# EAGLE board S7G7_footprint_simplified_w_ethernet_v1p17 (EAGLE 9.5.2)
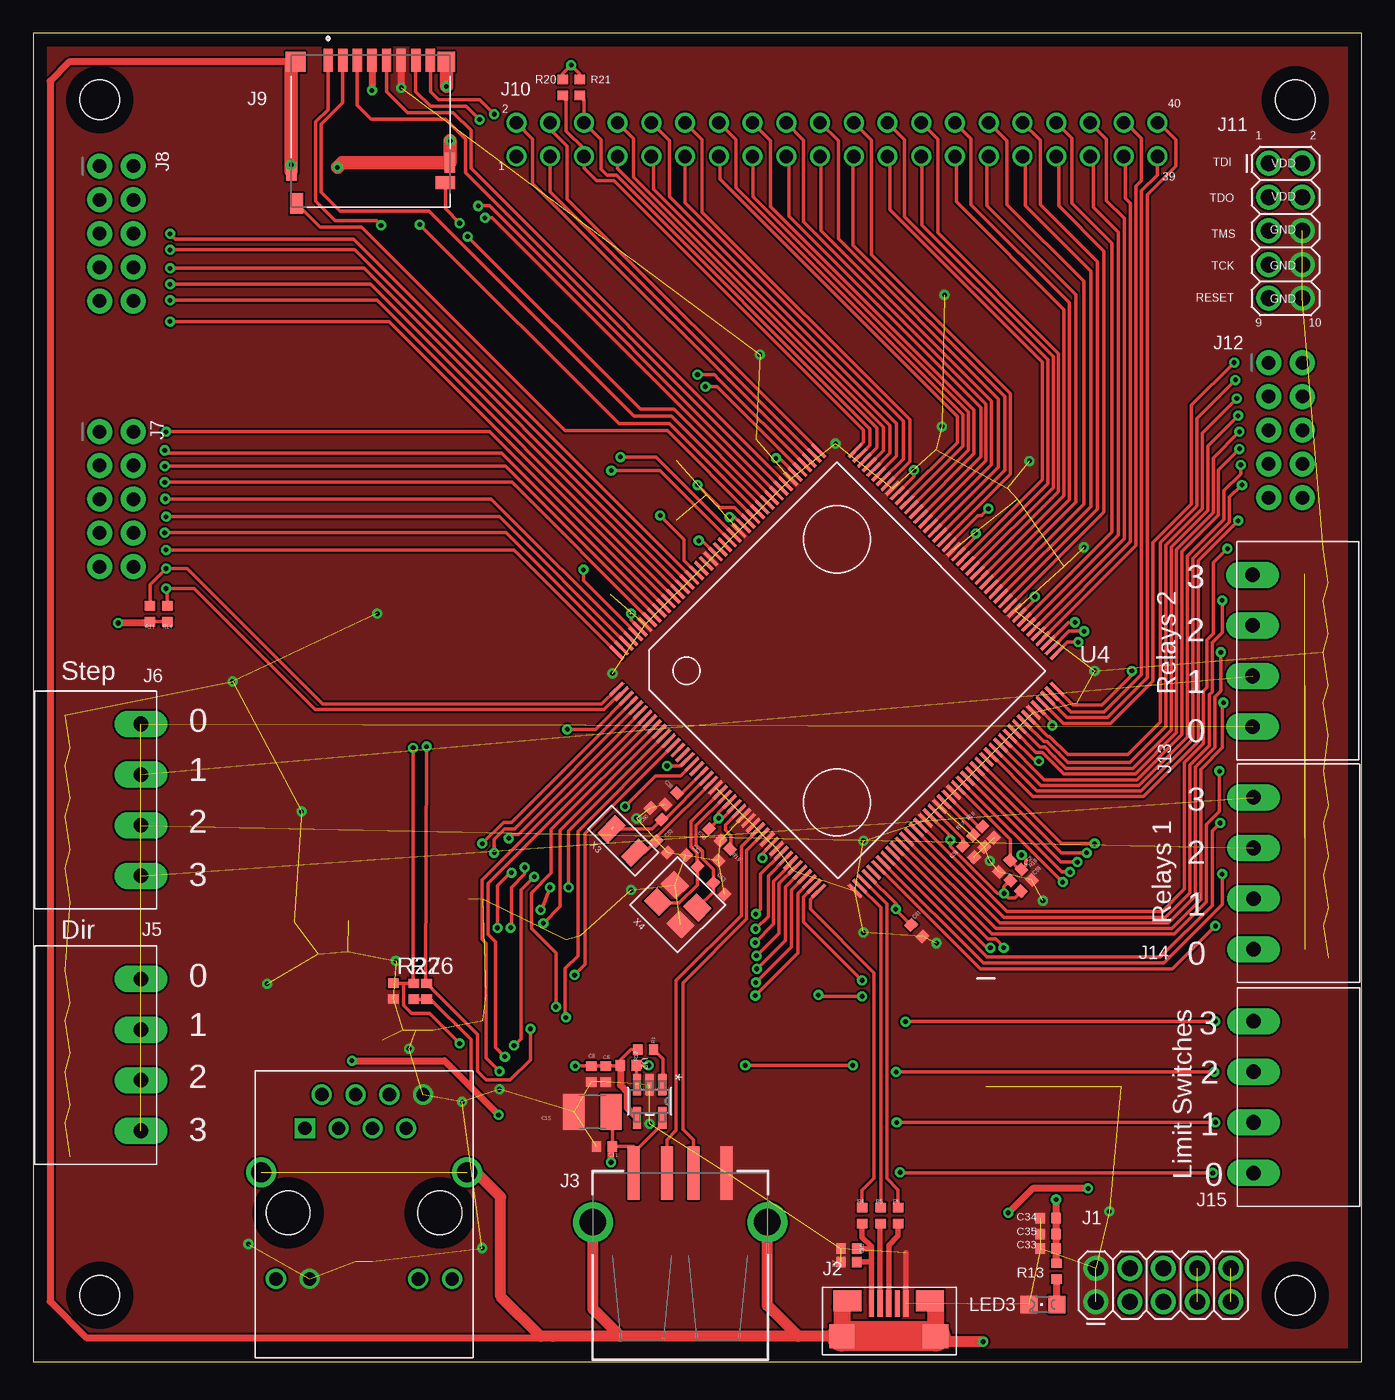
[diagram p5: board, top side]
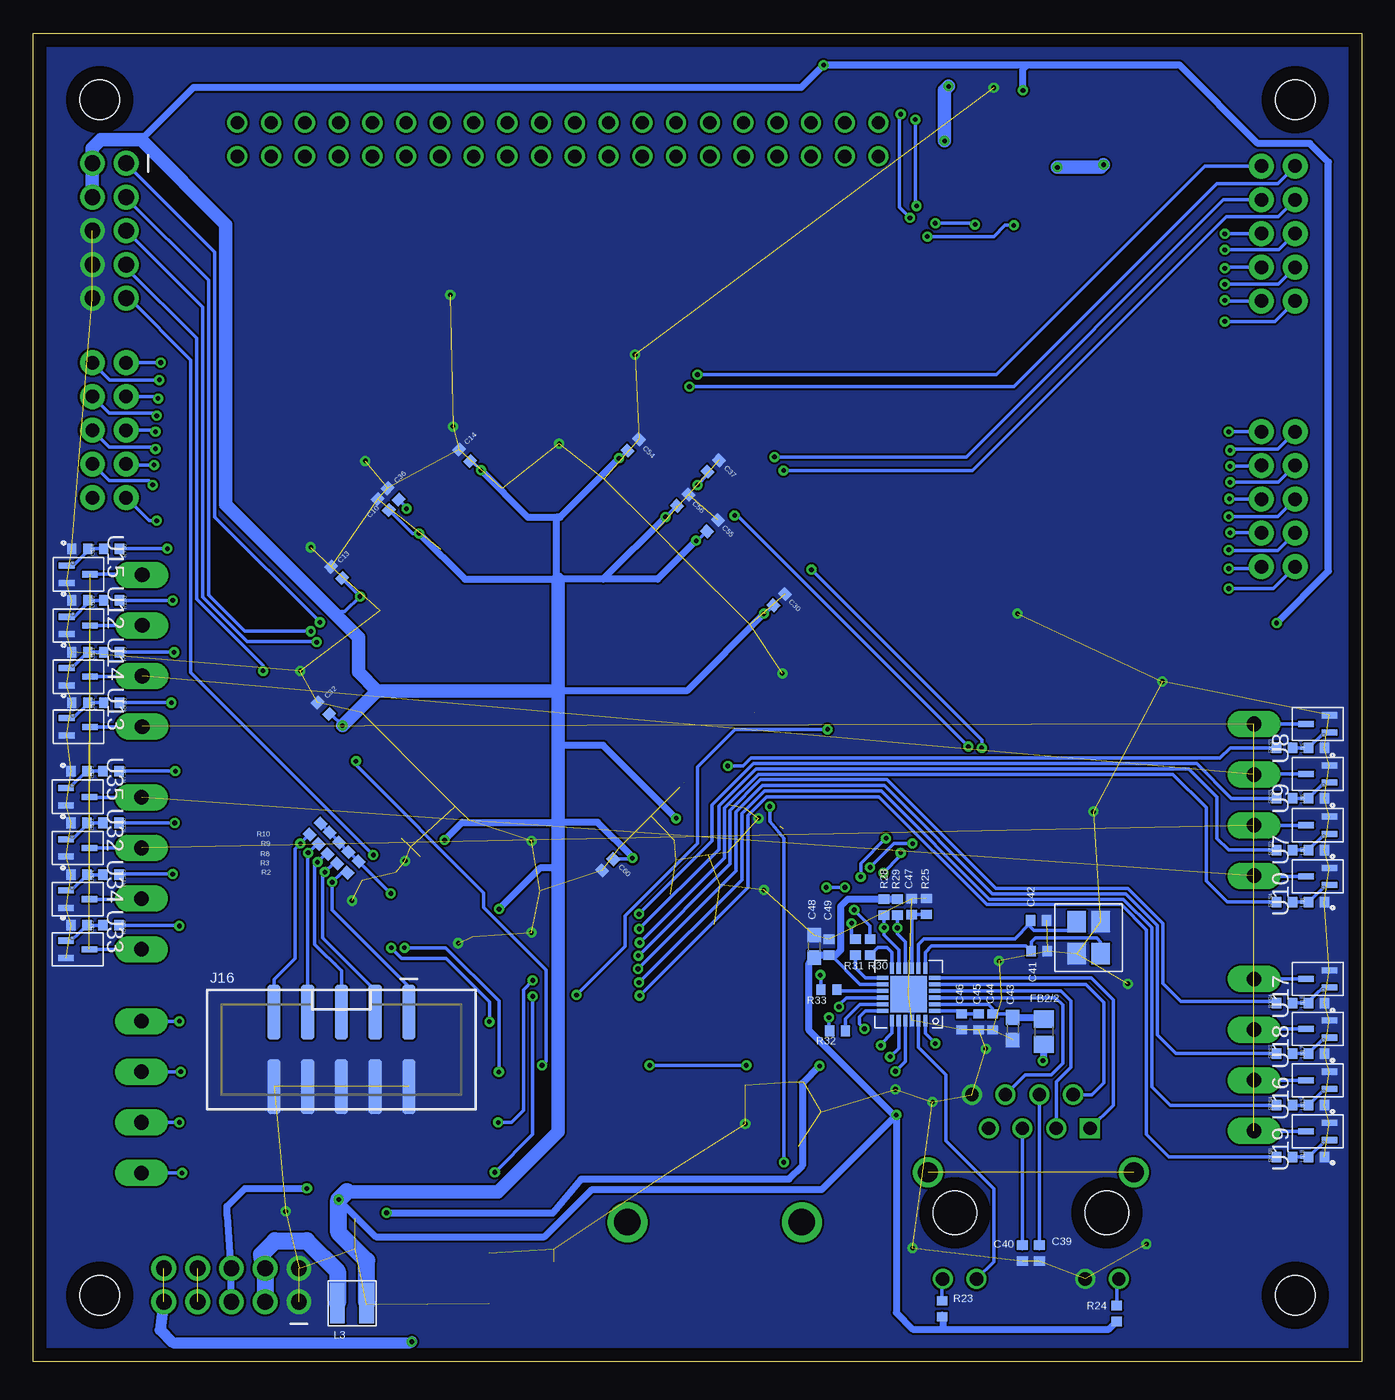
[diagram p6: board, bottom side, seen from below]

Size 100 x 100 mm. Coordinates in mm from the lower left corner, seen from the top.
Outline: 0,0 100,0 100,100 0,100 0,0
Copper layers (1*16): Top 0.035mm / dielectric 1.5mm / Bottom 0.035mm
Design rules "default": minimum track width 6mil, minimum drill 0.35mm, track to track 6mil, track to pad 6mil, pad to pad 6mil, via to via 6mil, smd to smd 6mil, copper to edge 40mil, drill to drill 6mil, minimum pad ring 10mil, minimum via ring 8mil, stop-mask expansion 4mil, vias tented up to drill 0mil, thermal gap 10mil
Holes 3 mm at 5,95 95,95 95,5 5,5

## Footprints (pad centres in the part's own frame; a part is rotated, then mirrored left to right if it is on the bottom)
0402 = smd 0.8 x 0.7: P$1 0,0.6; P$2 0,-0.6
C1210 = smd 1.6 x 2.7: 1 -1.4,0; 2 1.4,0
0603 = smd 1.1 x 1: 1 -0.85,0; 2 0.85,0
0805 = smd 1.3 x 1.5: 1 -0.95,0; 2 0.95,0
2X5 = drill 1.2 pad 1.88: 1 0,0; 2 0,2.54; 3 2.54,0; 4 2.54,2.54; 5 5.08,0; 6 5.08,2.54; 7 7.62,0; 8 7.62,2.54; 9 10.16,0; 10 10.16,2.54
USB_MICRO-B = smd 0.4 x 2: P$1 -1.3,2.475; P$2 -0.65,2.475; P$3 0,2.475; P$4 0.65,2.475; P$5 1.3,2.475 | smd 2.1 x 1.6: P$6 -3.1,2.675; P$7 3.1,2.675 | smd 1.9 x 1.8: P$8 -3.525,0; P$9 3.525,0
USB_A_SMT = smd 4 x 0.9: D+ 6.7,-1; D- 6.7,1; GND 6.7,-3.5; VBUS 6.7,3.5 | drill 2: SHLD1 3,-6.566; SHLD2 3,6.566
RJ45_TH_ELEC = drill 1 square: 1 -4.45,-2.54 | drill 1: 2 -3.18,0; 3 -1.91,-2.54; 4 -0.635,0; 5 0.635,-2.54; 6 1.91,0; 7 3.17,-2.54; 8 4.445,0; 9 -6.63,-13.88; 10 -4.09,-13.88; 11 4.09,-13.88; 12 6.63,-13.88 | drill 1.5: 13 -7.75,-5.84; 14 7.75,-5.84 | hole 3.299: 5.715,-8.89; -5.715,-8.89
1X4_3.81MM_PITCH = drill 1.1 pad 2 long: P$1 0,0; P$2 3.81,0; P$3 7.62,0; P$4 11.43,0
2X5_NOSILK = drill 1.016 pad 1.88: 1 0,0; 2 0,2.54; 3 2.54,0; 4 2.54,2.54; 5 5.08,0; 6 5.08,2.54; 7 7.62,0; 8 7.62,2.54; 9 10.16,0; 10 10.16,2.54
AMPHENOL_1140084168 = smd 0.7 x 1.75: 1 3.2,-0.875; 2 2.1,-0.875; 3 1,-0.875; 4 -0.1,-0.875; 5 -1.2,-0.875; 6 -2.3,-0.875; 7 -3.4,-0.875; 8 -4.5,-0.875 | smd 1 x 1.55: 9 5.575,9.925 | smd 1.45 x 1: 10 -5.625,8.35 | smd 1.5 x 1.5: S1 5.65,-0.75 | smd 1.3 x 1.5: S2 -5.7,-0.75 | smd 0.8 x 1.4: S3 5.975,7.5 | smd 0.8 x 1.5: S4 -5.95,6.85
HEADER_2_X_20_.1_INCH = drill 1: P$1 -24.13,-1.27; P$2 -24.13,1.27; P$3 -21.59,-1.27; P$4 -21.59,1.27; P$5 -19.05,-1.27; P$6 -19.05,1.27; P$7 -16.51,-1.27; P$8 -16.51,1.27; P$9 -13.97,-1.27; P$10 -13.97,1.27; P$11 -11.43,-1.27; P$12 -11.43,1.27; P$13 -8.89,-1.27; P$14 -8.89,1.27; P$15 -6.35,-1.27; P$16 -6.35,1.27; P$17 -3.81,-1.27; P$18 -3.81,1.27; P$19 -1.27,-1.27; P$20 -1.27,1.27; P$21 1.27,-1.27; P$22 1.27,1.27; P$23 3.81,-1.27; P$24 3.81,1.27; P$25 6.35,-1.27; P$26 6.35,1.27; P$27 8.89,-1.27; P$28 8.89,1.27; P$29 11.43,-1.27; P$30 11.43,1.27; P$31 13.97,-1.27; P$32 13.97,1.27; P$33 16.51,-1.27; P$34 16.51,1.27; P$35 19.05,-1.27; P$36 19.05,1.27; P$37 21.59,-1.27; P$38 21.59,1.27; P$39 24.13,-1.27; P$40 24.13,1.27
2X5-SHROUDED_SMD = smd 4.15 x 1: 1 -2.794,5.08; 2 2.794,5.08; 3 -2.794,2.54; 4 2.794,2.54; 5 -2.794,0; 6 2.794,0; 7 -2.794,-2.54; 8 2.794,-2.54; 9 -2.794,-5.08; 10 2.794,-5.08
1008_(2520_METRIC) = smd 3 x 1.1: 1 0,1.1; 2 0,-1.1
LED_0805_GREEN = smd 1.3 x 1.3: A 0,-1.05; C 0,1.05
SOT-23-5 = smd 1.626 x 0.61: 1 -1.245,0.95; 2 -1.245,0; 3 -1.245,-0.95; 4 1.245,-0.95; 5 1.245,0.95
QFN-24-M = smd 0.864 x 0.305: 1 -1.968,1.25; 2 -1.968,0.75; 3 -1.968,0.25; 4 -1.968,-0.25; 5 -1.968,-0.75; 6 -1.968,-1.25; 13 1.968,-1.25; 14 1.968,-0.75; 15 1.968,-0.25; 16 1.968,0.25; 17 1.968,0.75; 18 1.968,1.25 | smd 0.305 x 0.864: 7 -1.25,-1.968; 8 -0.75,-1.968; 9 -0.25,-1.968; 10 0.25,-1.968; 11 0.75,-1.968; 12 1.25,-1.968; 19 1.25,1.968; 20 0.75,1.968; 21 0.25,1.968; 22 -0.25,1.968; 23 -0.75,1.968; 24 -1.25,1.968 | smd 2.743 x 2.743: 25 0,0
LQFP176_24X24 = smd 1.372 x 0.254: 1 -12.675,10.75; 2 -12.675,10.25; 3 -12.675,9.75; 4 -12.675,9.25; 5 -12.675,8.75; 6 -12.675,8.25; 7 -12.675,7.75; 8 -12.675,7.25; 9 -12.675,6.75; 10 -12.675,6.25; 11 -12.675,5.75; 12 -12.675,5.25; 13 -12.675,4.75; 14 -12.675,4.25; 15 -12.675,3.75; 16 -12.675,3.25; 17 -12.675,2.75; 18 -12.675,2.25; 19 -12.675,1.75; 20 -12.675,1.25; 21 -12.675,0.75; 22 -12.675,0.25; 23 -12.675,-0.25; 24 -12.675,-0.75; 25 -12.675,-1.25; 26 -12.675,-1.75; 27 -12.675,-2.25; 28 -12.675,-2.75; 29 -12.675,-3.25; 30 -12.675,-3.75; 31 -12.675,-4.25; 32 -12.675,-4.75; 33 -12.675,-5.25; 34 -12.675,-5.75; 35 -12.675,-6.25; 36 -12.675,-6.75; 37 -12.675,-7.25; 38 -12.675,-7.75; 39 -12.675,-8.25; 40 -12.675,-8.75; 41 -12.675,-9.25; 42 -12.675,-9.75; 43 -12.675,-10.25; 44 -12.675,-10.75; 89 12.675,-10.75; 90 12.675,-10.25; 91 12.675,-9.75; 92 12.675,-9.25; 93 12.675,-8.75; 94 12.675,-8.25; 95 12.675,-7.75; 96 12.675,-7.25; 97 12.675,-6.75; 98 12.675,-6.25; 99 12.675,-5.75; 100 12.675,-5.25; 101 12.675,-4.75; 102 12.675,-4.25; 103 12.675,-3.75; 104 12.675,-3.25; 105 12.675,-2.75; 106 12.675,-2.25; 107 12.675,-1.75; 108 12.675,-1.25; 109 12.675,-0.75; 110 12.675,-0.25; 111 12.675,0.25; 112 12.675,0.75; 113 12.675,1.25; 114 12.675,1.75; 115 12.675,2.25; 116 12.675,2.75; 117 12.675,3.25; 118 12.675,3.75; 119 12.675,4.25; 120 12.675,4.75; 121 12.675,5.25; 122 12.675,5.75; 123 12.675,6.25; 124 12.675,6.75; 125 12.675,7.25; 126 12.675,7.75; 127 12.675,8.25; 128 12.675,8.75; 129 12.675,9.25; 130 12.675,9.75; 131 12.675,10.25; 132 12.675,10.75 | smd 0.254 x 1.372: 45 -10.75,-12.675; 46 -10.25,-12.675; 47 -9.75,-12.675; 48 -9.25,-12.675; 49 -8.75,-12.675; 50 -8.25,-12.675; 51 -7.75,-12.675; 52 -7.25,-12.675; 53 -6.75,-12.675; 54 -6.25,-12.675; 55 -5.75,-12.675; 56 -5.25,-12.675; 57 -4.75,-12.675; 58 -4.25,-12.675; 59 -3.75,-12.675; 60 -3.25,-12.675; 61 -2.75,-12.675; 62 -2.25,-12.675; 63 -1.75,-12.675; 64 -1.25,-12.675; 65 -0.75,-12.675; 66 -0.25,-12.675; 67 0.25,-12.675; 68 0.75,-12.675; 69 1.25,-12.675; 70 1.75,-12.675; 71 2.25,-12.675; 72 2.75,-12.675; 73 3.25,-12.675; 74 3.75,-12.675; 75 4.25,-12.675; 76 4.75,-12.675; 77 5.25,-12.675; 78 5.75,-12.675; 79 6.25,-12.675; 80 6.75,-12.675; 81 7.25,-12.675; 82 7.75,-12.675; 83 8.25,-12.675; 84 8.75,-12.675; 85 9.25,-12.675; 86 9.75,-12.675; 87 10.25,-12.675; 88 10.75,-12.675; 133 10.75,12.675; 134 10.25,12.675; 135 9.75,12.675; 136 9.25,12.675; 137 8.75,12.675; 138 8.25,12.675; 139 7.75,12.675; 140 7.25,12.675; 141 6.75,12.675; 142 6.25,12.675; 143 5.75,12.675; 144 5.25,12.675; 145 4.75,12.675; 146 4.25,12.675; 147 3.75,12.675; 148 3.25,12.675; 149 2.75,12.675; 150 2.25,12.675; 151 1.75,12.675; 152 1.25,12.675; 153 0.75,12.675; 154 0.25,12.675; 155 -0.25,12.675; 156 -0.75,12.675; 157 -1.25,12.675; 158 -1.75,12.675; 159 -2.25,12.675; 160 -2.75,12.675; 161 -3.25,12.675; 162 -3.75,12.675; 163 -4.25,12.675; 164 -4.75,12.675; 165 -5.25,12.675; 166 -5.75,12.675; 167 -6.25,12.675; 168 -6.75,12.675; 169 -7.25,12.675; 170 -7.75,12.675; 171 -8.25,12.675; 172 -8.75,12.675; 173 -9.25,12.675; 174 -9.75,12.675; 175 -10.25,12.675; 176 -10.75,12.675
SOT323 = smd 0.457 x 1.168: 1 -0.65,-0.876; 2 0.65,-0.876; 3 0,0.876
SMD_3225 = smd 1.6 x 1.4: 1 -1.2,-0.9; 2 1.2,-0.9; 3 1.2,0.9; 4 -1.2,0.9
SMD_X_2_PADS = smd 1.9 x 1.1: P$1 0,1.25; P$2 0,-1.25

## Placement (x,y rotation side)
C5  10uF  [0402]  43.1,21.65 0 top
C8  0.1uF  [0402]  42,21.65 0 top
C10  0.1uF  [0402]  73.65,64.52 45 bottom
C11  0.1uF  [0402]  43,16.2 270 top
C13  0.1uF  [0402]  77.16,59.41 45 bottom
C14  0.1uF  [0402]  67.53,68.22 45 bottom
C15  100uF  [C1210]  42.1,18.8 180 top
C16  1uF  [0402]  61.4,8.5 270 top
C30  0.1uF  [0402]  43.85,57.36 315 bottom
C31  0.1uF  [0402]  70.4,38.4 45 top
C32  1uF  [0402]  78.16,49.19 225 bottom
C33  0.1uF  [0402]  76.4,8.5 270 top
C34  0.1uF  [0402]  76.4,10.8 270 top
C35  10uF  [0402]  76.4,9.6 270 top
C36  0.1uF  [0402]  72.91,65.32 45 bottom
C37  0.1uF  [0402]  48.81,67.42 315 bottom
C38  0.1uF  [0402]  48.03,42.37 315 top
C39  0.1uF  [0402]  24.26,8.17 0 bottom
C40  0.1uF  [0402]  25.54,8.17 0 bottom
C41  24pF  [0402]  24.27,30.89 90 bottom
C42  24pF  [0402]  24.32,33.21 90 bottom
C43  22uF  [0603]  26.26,25.06 270 bottom
C44  0.1uF  [0402]  27.79,25.58 0 bottom
C45  2.2uF  [0402]  28.82,25.58 0 bottom
C46  .1uF  [0402]  30.1,25.58 0 bottom
C47  100pF  [0402]  33.86,34.24 180 bottom
C48  22uF  [0603]  41.2,31.25 90 bottom
C49  0.1uF  [0402]  40.1,31.2 180 bottom
C50  12pF  [0402]  46.88,41.24 225 top
C51  12pF  [0402]  47.32,38.77 45 top
C52  18pF  [0402]  49.57,37.7 225 top
C53  18pF  [0402]  51.62,35.6 45 top
C54  0.1uF  [0402]  54.83,69.01 315 bottom
C55  0.1uF  [0402]  48.86,62.93 315 bottom
C56  0.1uF  [0402]  51.1,64.85 315 bottom
C57  10uF  [0402]  73.12,37.3 315 top
C58  0.1uF  [0402]  51.31,39.66 45 top
C59  0.1uF  [0402]  74.76,35.84 135 top
C60  0.1uF  [0402]  56.76,37.4 315 bottom
C61  0.1uF  [0402]  66.51,32.44 225 top
FB2/2  [0805]  23.92,24.83 90 bottom
J1  [2X5]  80,4.5 0 top
J2  [USB_MICRO-B]  64.4,1.9 0 top
J3  [USB_A_SMT]  48.7,7.5 90 top
J4  [RJ45_TH_ELEC]  24.9,20.1 0 top
J5  [1X4_3.81MM_PITCH]  8.1,28.8 270 top
J6  [1X4_3.81MM_PITCH]  8.1,48 270 top
J7  [2X5_NOSILK]  5,70 270 top
J8  [2X5_NOSILK]  5,90 270 top
J9  SD_CARD_1140084168  [AMPHENOL_1140084168]  25.4,97.1 180 top
J10  [HEADER_2_X_20_.1_INCH]  60.5,92 0 top
J11  [2X5]  93,90.2 270 top
J12  [2X5_NOSILK]  93,75.2 270 top
J13  [1X4_3.81MM_PITCH]  91.8,47.8 90 top
J14  [1X4_3.81MM_PITCH]  91.85,31.05 90 top
J15  [1X4_3.81MM_PITCH]  91.85,14.2 90 top
J16  [2X5-SHROUDED_SMD]  76.8,23.5 270 bottom
L3  2.2uH  [1008_(2520_METRIC)]  76,4.4 90 bottom
LED3  LED_0805_GREEN  [LED_0805_GREEN]  76,4.3 90 top
R1  10K0  [0402]  46.1,23.5 270 top
R2  1K  [0402]  75.93,37.23 315 bottom
R3  1K  [0402]  76.7,37.94 315 bottom
R4  15K0  [0402]  62.4,11 0 top
R5  27R0  [0402]  63.8,11 0 top
R6  27R0  [0402]  65.1,11 0 top
R7  30K0  [0402]  61.4,7.5 90 top
R8  1K  [0402]  77.4,38.65 315 bottom
R9  1K  [0402]  78.1,39.4 315 bottom
R10  1K  [0402]  78.78,40.1 315 bottom
R11  1K  [0402]  8.8,56.3 180 top
R12  10K0  [0402]  44.8,22.3 270 top
R13  470R  [0402]  77.03,6.81 180 top
R14  1K  [0402]  10.1,56.3 180 top
R16  10K  [0402]  71.87,39.86 225 top
R17  10K  [0402]  71.18,39.17 225 top
R18  10K  [0402]  73.97,36.63 315 top
R19  2.2K  [0402]  52.02,38.16 135 top
R20  1K  [0402]  39.85,95.92 0 top
R21  1K  [0402]  41.13,95.92 0 top
R23  470  [0402]  31.59,3.98 0 bottom
R24  470  [0402]  18.44,3.63 0 bottom
R25  6k49  [0402]  32.76,34.27 0 bottom
R26  10K  [0402]  29.61,27.88 0 top
R27  10K  [0402]  28.64,27.88 0 top
R28  1K50  [0402]  35.96,34.22 180 bottom
R29  1K50  [0402]  34.94,34.22 180 bottom
R30  33  [0402]  37,31.2 0 bottom
R31  33  [0402]  38.1,31.2 0 bottom
R32  33  [0402]  39.45,24.9 90 bottom
R33  33  [0402]  40.1,28 90 bottom
RXS2  1K  [0402]  5.8,46.2 90 bottom
RXS3  1K  [0402]  94.1,49.6 270 bottom
RXS4  1K  [0402]  5.8,27 90 bottom
RXS8  1K  [0402]  94.15,32.85 270 bottom
RYS3  1K  [0402]  5.8,42.4 90 bottom
RYS4  1K  [0402]  5.8,34.6 90 bottom
RYS5  1K  [0402]  94.1,53.4 270 bottom
RYS6  1K  [0402]  94.1,61.2 270 bottom
RYS7  1K  [0402]  5.8,23.2 90 bottom
RYS8  1K  [0402]  5.8,15.4 90 bottom
RYS15  1K  [0402]  94.15,36.65 270 bottom
RYS16  1K  [0402]  94.15,44.45 270 bottom
RZS2  1K  [0402]  5.8,38.5 90 bottom
RZS3  1K  [0402]  94.1,57.3 270 bottom
RZS4  1K  [0402]  5.8,19.3 90 bottom
RZS8  1K  [0402]  94.15,40.55 270 bottom
U2  AP2141DWG-5  [SOT-23-5]  46.4,19.6 270 top
U3  KSZ8081RNACAQFN-24-M  [QFN-24-M]  34.1,27.65 180 bottom
U4  [LQFP176_24X24]  60.5,52 45 top
U7  [SOT323]  3.3,40.38 90 bottom
U8  [SOT323]  3.3,48.01 90 bottom
U9  [SOT323]  3.3,44.24 90 bottom
U10  [SOT323]  3.3,36.53 90 bottom
U12  [SOT323]  96.6,55.42 270 bottom
U13  [SOT323]  96.6,47.79 270 bottom
U14  [SOT323]  96.6,51.56 270 bottom
U15  [SOT323]  96.6,59.27 270 bottom
U16  [SOT323]  3.3,21.18 90 bottom
U17  [SOT323]  3.3,28.81 90 bottom
U18  [SOT323]  3.3,25.04 90 bottom
U19  [SOT323]  3.3,17.33 90 bottom
U32  [SOT323]  96.65,38.67 270 bottom
U33  [SOT323]  96.65,31.04 270 bottom
U34  [SOT323]  96.65,34.81 270 bottom
U35  [SOT323]  96.65,42.52 270 bottom
U$1  1K  [0402]  3.4,38.5 90 bottom
U$3  [SMD_3225]  20.55,31.91 270 bottom
U$4  10uF  [0402]  27.11,27.9 0 top
U$5  1K  [0402]  3.4,46.2 90 bottom
U$6  1K  [0402]  3.4,42.4 90 bottom
U$8  1K  [0402]  3.4,34.6 90 bottom
U$10  1K  [0402]  96.5,57.3 270 bottom
U$12  1K  [0402]  96.5,49.6 270 bottom
U$13  1K  [0402]  96.5,53.4 270 bottom
U$14  1K  [0402]  96.5,61.2 270 bottom
U$15  1K  [0402]  3.4,19.3 90 bottom
U$16  1K  [0402]  3.4,27 90 bottom
U$17  1K  [0402]  3.4,23.2 90 bottom
U$18  1K  [0402]  3.4,15.4 90 bottom
U$32  1K  [0402]  96.55,40.55 270 bottom
U$33  1K  [0402]  96.55,32.85 270 bottom
U$34  1K  [0402]  96.55,36.65 270 bottom
U$35  1K  [0402]  96.55,44.45 270 bottom
X3  32.768KHZ  [SMD_X_2_PADS]  44.41,39.2 45 top
X4  24MHZ  [SMD_3225]  48.51,34.39 315 top

## Tracks (layer width: path | path; a pad name or v marks a point on that pad's centre or on a via)
C58
  Bottom 0.254: J4.4 24.27,8.5 C39.P$1
C60
  Bottom 0.254: J4.5 25.54,8.5 C40.P$1
CRS_DV
  Bottom 0.254: U3.15 39.4,27.9 R33.P$2
D+
  Top 0.4: J2.P$3 64.4,8.78 65.1,9.47 R6.P$2
D-
  Top 0.4: J2.P$2 63.75,10.35 R5.P$2
ETH  (via drill 0.35)
  Top 0.254: v39.35,26.7 39.35,30.75 37.5,32.6 37.5,35.3 39,36.8 39,40.05 U4.9
  Bottom 0.254: U3.16 38.8,27.4 39.35,26.85 v39.35,26.7
ETH_CRS_DV  (via drill 0.35)
  Top 0.254: v40.75,29.1 41.55,29.9 41.55,39.77 U4.13
  Bottom 0.254: v40.75,29.1 40.7,29.05 R33.P$1
ETH_IRQ14  (via drill 0.35)
  Top 0.254: v37.43,25.05 37.43,22.73 35.89,21.19 34.11,21.19 33.46,21.84 33.46,24.63 R26.P$1 29.54,28.55 v29.6,46.3 | v47.2,63.7 49,61.9 49,60.32 U4.159
  Bottom 0.254: U3.18 37.35,26.4 37.8,25.95 37.8,25.42 v37.43,25.05 | v47.2,63.7 47,63.7 v29.6,46.3
ETH_MDC  (via drill 0.35)
  Top 0.254: v33.8,39 35.4,40.6 36.02,40.6 U4.4 | v37,37.2 37,36.7 36,35.7 36,32.71 v35.95,32.66
  Bottom 0.254: U3.11 34.85,31 35.96,32.11 v35.95,32.66 R28.P$1 | v33.8,39 35.2,39 v37,37.2
ETH_MDIO  (via drill 0.35)
  Top 0.254: v34.94,32.65 34.94,35.85 35.89,36.8 v36,36.8 | v34.7,38.3 34.7,39.3 35.5,40.1 36.23,40.1 U4.5
  Bottom 0.254: U3.10 34.35,31.6 34.94,32.19 v34.94,32.65 R29.P$1 | v34.7,38.3 34.7,38.1 v36,36.8
ETH_RESET  (via drill 0.35)
  Top 0.254: v28.6,46.2 28.6,28.52 R27.P$1 27.9,28.48 | v41.41,59.61 41.41,58.81 45.35,54.88 U4.172 | 27.9,28.48 27.13,28.48 U$4.P$1 | 27.9,28.48 27.9,26.8 28.5,26.2 29.85,26.2 v32.1,23.95
  Bottom 0.254: U3.24 32.85,24.7 v32.1,23.95 | v41.41,59.61 28.6,46.8 v28.6,46.2
ETH_RX_ER  (via drill 0.35)
  Top 0.254: v40.1,25.9 40.05,25.95 40.05,29.6 41,30.55 41,39.92 U4.12
  Bottom 0.254: R32.P$1 40.1,24.95 v40.1,25.9
ETH_RXD0  (via drill 0.35)
  Top 0.254: v38.4,33 39.65,34.25 39.65,39.99 U4.10
  Bottom 0.254: v38.4,33 38.4,32.1 R31.P$1
ETH_RXD1  (via drill 0.35)
  Top 0.254: v38.9,35.69 38.29,34.09 v38.2,34 | v40.3,35.7 40.3,39.95 47.47,47.12 U4.11
  Bottom 0.254: v38.2,34 37,32.8 R30.P$1 | v40.3,35.7 v38.9,35.69
ETH_TXD0  (via drill 0.35)
  Top 0.254: v35.5,22.95 34.8,23.65 34.8,31.6 34.25,32.15 34.25,36 U4.8
  Bottom 0.254: U3.20 34.85,23.6 v35.5,22.95
ETH_TXD1  (via drill 0.35)
  Top 0.254: v35.1,21.85 34.1,22.85 34.1,31.5 33.8,31.8 33.8,36.24 46.06,48.5 U4.7
  Bottom 0.254: U3.21 34.35,22.6 v35.1,21.85
ETH_TXD_EN  (via drill 0.35)  (1 unrouted)
  Top 0.254: v36.2,23.8 36.71,24.31 36.71,35.5 v37.71,36.5 | v35.8,39.4 36.09,39.69 36.53,39.69 U4.6
  Bottom 0.254: U3.19 35.35,24.75 36.2,23.9 v36.2,23.8 | v35.8,39.4 35.83,39.4 37.71,37.52 v37.71,36.5
F0_OUT  (3 unrouted)
  Bottom 0.254: U8.3 J6.P$1 | U17.3 J5.P$1 | U33.3 J14.P$1 | U13.3 J13.P$1
F1_OUT  (3 unrouted)
  Bottom 0.254: U9.3 8.05,44.24 J6.P$2 | U18.3 8.05,25.04 J5.P$2 | U34.3 91.9,34.81 J14.P$2 | U14.3 91.85,51.56 J13.P$2
F2_OUT  (3 unrouted)
  Bottom 0.254: U7.3 J6.P$3 | U16.3 J5.P$3 | U32.3 J14.P$3 | U12.3 J13.P$3
F3_OUT  (3 unrouted)
  Bottom 0.254: U10.3 8.06,36.53 J6.P$4 | U19.3 8.06,17.33 J5.P$4 | U35.3 95.73,42.48 J14.P$4 | U15.3 91.84,59.27 J13.P$4
GND  (via drill 0.35)  (145 unrouted)
  Top 0.4: J2.P$5 65.7,8.2
  Top 0.508: J9.6 v27.7,95.9
  other vias: 15,51.2 28.3,23.55 32.3,19.55 27.3,30.15 33.8,8.55 16.2,8.85 17.6,28.45 35.1,20.5 46.4,17.9 45,35.5 43.61,51.82 62.5,32.3 72,37.7 68.6,80.3 68.4,70.4 54.7,75.8 60.4,69.1 62.5,39.2 79.9,52 20.2,41.4 25.9,56.3 81,11.3 45.4,40.9 76,34.7 68,31.5 79.1,61.3 75,67.8
  pour Bottom (no thermals): 67,0 100,0 100,100 0,100 0,0
  pour Top (no thermals): 0,0 100,0 100,100 0,100
GNDE  (via drill 0.35)  (2 unrouted)
  Top 0.508: J9.S1 2.72,97.85 1.27,96.4 1.27,4.53 4,1.8 39,1.8 39.1,1.9
  Top 0.813: v71.5,1.5 68.33,1.5 J2.P$9 | J2.P$7 67.92,4.15 | J2.P$6 60.88,4.15 | J2.P$8 57.6,1.9 | J3.SHLD1 55.27,4.23 57.6,1.9 | 57.6,1.9 44.2,1.9 | J3.SHLD2 42.13,3.97 44.2,1.9 | 44.2,1.9 39.1,1.9 38.2,1.9 35.2,4.9 35.2,12.4 33.34,14.26 J4.14
  Top 1.016: J9.S3 v19.43,90.1 19.43,97.53 J9.S1 | v22.9,89.9 23.25,90.25 J9.S4 31.4,90.3 v31.4,91.9 | J9.S2 v31.1,96
  Top 1.27: 67.92,4.15 J2.P$9 | 60.88,4.15 J2.P$8
  Top 2.25: J2.P$9 J2.P$8
  Bottom 0.813: J1.9 90.46,2.38 89.5,1.42 71.58,1.42 v71.5,1.5
  Bottom 1.016: v22.9,89.9 19.62,89.9 v19.43,90.1 | v31.1,96 31.4,95.7 v31.4,91.9
GP4
  Top 0.254: U4.49 63.31,36.81 63.31,36.8
GP21
  Top 0.254: U4.73
IIC_0_SCL  (via drill 0.35)
  Top 0.254: U4.1 42.8,49.5 21.8,49.5 11.6,59.7 v10,59.7 8.8,58.5 R11.P$2
  Bottom 0.254: v10,59.7 7.68,59.7 J7.10
IIC_0_SDA  (via drill 0.35)
  Top 0.254: U4.2 44.16,50.29 42.97,49.09 21.21,49.09 12.1,58.2 v10,58.2 10.1,58.1 R14.P$2
  Bottom 0.254: v10,58.2 6.64,58.2 J7.9
IIC_1_SCL
  Top 0.254: U4.132 62.5,69.2 62.5,70.12 43.73,88.89 42.41,88.89 41.45,89.85 J10.P$5 41.45,91.31 40.12,92.64 40.12,94.95 39.85,95.22 R20.P$2
IIC_1_SDA
  Top 0.254: U4.131 63,69 63,70.2 43.9,89.3 43.18,89.3 42.73,89.75 42.73,91.99 J10.P$6 | 41.11,95.29 R21.P$2 41.46,94.99 J10.P$6 | J10.P$6
INT_AI_LS_0  (via drill 0.35)
  Top 0.254: U4.3 42.31,47.6 v40.2,47.6 | v62.4,27.5 59.2,27.5 v59.1,27.6 | v65.25,14.25 65.3,14.2 v88.8,14.2
  Bottom 0.254: v40.2,47.6 47.18,47.6 50,44.78 50,39.02 55.46,33.56 55.46,31.24 v59.1,27.6 | v65.25,14.25 62.4,17.1 v62.4,27.5 | v88.8,14.2 J15.P$1
INT_AI_LS_1  (via drill 0.35)
  Top 0.254: U4.43 58.79,35.76 57.99,34.97 57.99,33.11 v62.4,28.7 | v65,18 v65.01,18.01 v89,18.01
  Bottom 0.254: v62.4,28.7 63.1,28 63.1,18.9 64,18 v65,18 | v89,18.01 J15.P$2
INT_AI_LS_2  (via drill 0.35)
  Top 0.254: U4.53 71.8,31.15 v72.05,31.15 | v64.95,21.8 64.97,21.82 v88.9,21.82
  Bottom 0.254: v88.9,21.82 J15.P$3 | v72.05,31.15 68.95,31.15 64.95,27.15 v64.95,21.8
INT_AI_LS_3  (via drill 0.35)
  Top 0.254: U4.54 71.85,31.81 72.45,31.81 73.05,31.21 v73.05,31.15 | v65.66,25.59 65.7,25.63 v89,25.63
  Bottom 0.254: v89,25.63 J15.P$4 | v65.66,25.59 65.66,27.09 68.92,30.35 72.25,30.35 v73.05,31.15
INT_MI_01
  Top 0.254: U4.87 78.1,48.9 80.6,48.9 83.43,51.73 83.43,88.13 84.63,89.33 J10.P$39
INT_MI_02
  Top 0.254: U4.86 77.8,48.49 80.87,48.49 83.86,51.48 83.86,87.86 86,90 86,92 84.73,93.27 J10.P$40
INT_MI_03
  Top 0.254: U4.128 64.5,68.37 64.5,70.45 46.7,88.25 46.7,90.56 J10.P$9
INT_MI_04
  Top 0.254: U4.127 64.99,68.16 64.99,70.6 47.9,87.69 47.9,91.9 J10.P$10
LED1/SPEED
  Bottom 0.254: U3.23 33.35,23.65 31.3,21.6 31.3,16.63 27.69,13.02 27.69,7.52 J4.11
M0_DIR  (via drill 0.35)
  Top 0.254: U4.39 56.15,35.98 56.15,32.25 v54.45,30.55
  Bottom 0.254: RXS4.P$1 6.5,27.1 13.6,27.1 14.98,28.48 14.98,33.01 17.59,35.62 27.54,35.62 35.73,43.81 45.24,43.81 47.55,41.5 47.55,37.45 v54.45,30.55
M0_STEP  (via drill 0.35)
  Top 0.254: 49.24,45.32 U4.16 48.74,44.84 v47.72,44.84
  Bottom 0.254: RXS2.P$1 9.9,46.2 10.67,45.43 45.96,45.43 46.56,44.84 v47.72,44.84
M1_DIR  (via drill 0.35)
  Top 0.254: U4.40 56.62,35.74 56.62,31.72 v54.47,29.57
  Bottom 0.254: v54.47,29.57 47.1,36.94 47.1,41.38 45.12,43.36 35.93,43.36 27.79,35.21 17.76,35.21 15.39,32.84 15.39,24.59 14,23.2 RYS7.P$1
M1_STEP  (via drill 0.35)
  Top 0.254: U4.36 54.75,36.7 54.75,34.04 v54.4,33.69
  Bottom 0.254: v54.4,33.69 48.9,39.19 48.9,41.92 45.79,45.03 12.42,45.03 9.79,42.4 RYS3.P$1
M2_DIR  (via drill 0.35)
  Top 0.254: v54.39,28.54 57.09,31.24 57.09,35.51 U4.41
  Bottom 0.254: RZS4.P$1 14.4,19.3 15.79,20.69 15.79,32.67 17.93,34.81 28.01,34.81 36.15,42.95 44.95,42.95 46.65,41.25 46.65,36.28 v54.39,28.54
M2_STEP  (via drill 0.35)
  Top 0.254: U4.37 55.33,36.58 55.33,33.52 v54.38,32.57
  Bottom 0.254: v54.38,32.57 48.38,38.57 48.38,41.82 45.58,44.62 13.02,44.62 10.9,42.5 10.9,39.4 10,38.5 RZS2.P$1
M3_DIR  (via drill 0.35)
  Top 0.254: U4.42 57.55,35.26 57.55,30.75 v54.35,27.55
  Bottom 0.254: v54.35,27.55 46.2,35.7 46.2,41.12 44.82,42.51 36.33,42.51 28.23,34.4 18.1,34.4 16.2,32.5 16.2,17.1 14.5,15.4 RYS8.P$1
M3_STEP  (via drill 0.35)
  Top 0.254: U4.38 57.02,37.42 55.74,36.15 55.74,32.94 v54.34,31.54
  Bottom 0.254: v54.34,31.54 47.96,37.92 47.96,41.67 45.41,44.21 14.21,44.21 11.7,41.7 11.7,36.2 10.1,34.6 RYS4.P$1
N$1  (via drill 0.35)
  Top 0.254: U4.148 52.8,64.3 51.7,64.3 v50,66
  Bottom 0.254: v50,66 49.23,66.77 C37.P$2
N$3
  Top 0.508: R13.P$1 77.03,4.32 LED3.A
N$4
  Top 0.254: U4.19 48.82,42.8 C38.P$1
N$5
  Top 0.254: U4.62 69.98,39.34 C31.P$1
N$6
  Top 0.254: R17.P$2 70.76,39.97 U4.64
N$7
  Top 0.254: U4.65 71.15,40.29 R16.P$2
N$8  (1 unrouted)
  Top 0.254: 52.52,40.84 U4.27 52.1,40.42 52.1,40.03 52.54,39.59 52.54,38.68 R19.P$2
N$11
  Bottom 0.254: U7.1 2.75,39.73 2.88,39.62 U$1.P$1 RZS2.P$2
N$12
  Bottom 0.254: U8.1 2.8,47.36 U$5.P$1 RXS2.P$2
N$13
  Bottom 0.254: U9.1 2.81,43.59 U$6.P$1 RYS3.P$2
N$14
  Bottom 0.254: U10.1 2.62,35.88 U$8.P$1 RYS4.P$2
N$15
  Bottom 0.254: U12.1 96.93,56.07 95.9,57.1 U$10.P$1 RZS3.P$2
N$16
  Bottom 0.254: U13.1 97,48.44 95.9,49.5 U$12.P$1 RXS3.P$2
N$17
  Bottom 0.254: U14.1 97.09,52.21 U$13.P$1 RYS5.P$2
N$18
  Bottom 0.254: U15.1 96.98,59.92 95.9,61 U$14.P$1 RYS6.P$2
N$19
  Bottom 0.254: U16.1 2.75,20.53 2.88,20.43 U$15.P$1 RZS4.P$2
N$20
  Bottom 0.254: U17.1 2.9,28.16 4,27.1 U$16.P$1 RXS4.P$2
N$22
  Bottom 0.254: U18.1 2.81,24.39 U$17.P$1 RYS7.P$2
N$23
  Bottom 0.254: U19.1 2.62,16.68 U$18.P$1 RYS8.P$2
N$36
  Bottom 0.254: U32.1 97.08,39.32 95.95,40.45 U$32.P$1 RZS8.P$2
N$37
  Bottom 0.254: U33.1 97.15,31.69 U$33.P$1 RXS8.P$2
N$38
  Bottom 0.254: U34.1 97.14,35.46 U$34.P$1 RYS15.P$2
N$39
  Bottom 0.254: U35.1 97.33,43.17 U$35.P$1 RYS16.P$2
P0_00  (via drill 0.35)
  Top 0.254: U4.169 36.05,66.2 v9.9,66.2
  Bottom 0.254: v9.9,66.2 6.26,66.2 J7.3
P0_01  (via drill 0.35)
  Top 0.254: U4.168 35.55,67.4 v9.9,67.4
  Bottom 0.254: v9.9,67.4 7.6,67.4 J7.4
P0_02  (via drill 0.35)
  Top 0.254: v9.9,68.6 10.1,68.4 35.26,68.4 U4.167
  Bottom 0.254: v9.9,68.6 9.8,68.7 6.3,68.7 J7.1
P0_03  (via drill 0.35)
  Top 0.254: U4.166 34.37,70 v10,70
  Bottom 0.254: v10,70 J7.2
P0_04  (via drill 0.35)
  Top 0.254: v10.3,78.3 26.77,78.3 U4.165
  Bottom 0.254: J8.9 6.54,78.3 v10.3,78.3
P0_05  (via drill 0.35)
  Top 0.254: v10.3,79.9 25.88,79.9 U4.164
  Bottom 0.254: J8.10 10.24,79.84 v10.3,79.9
P0_06  (via drill 0.35)
  Top 0.254: U4.163 25.39,81.1 v10.3,81.1
  Bottom 0.254: J8.7 6.28,81.1 v10.3,81.1
P0_07  (via drill 0.35)
  Top 0.254: 48.85,58.31 U4.162 24.9,82.3 v10.3,82.3
  Bottom 0.254: J8.8 10.22,82.38 v10.3,82.3
P0_08  (via drill 0.35)
  Top 0.254: v10.3,83.7 24.2,83.7 U4.161
  Bottom 0.254: J8.5 6.22,83.7 v10.3,83.7
P0_09  (via drill 0.35)
  Top 0.254: v10.3,84.9 10.7,84.5 24.11,84.5 U4.160
  Bottom 0.254: J8.6 10.28,84.92 v10.3,84.9
P0_14  (via drill 0.35)
  Top 0.254: U4.152 47.18,67.08 v43.52,67.08
  Bottom 0.254: J8.3 6.26,86.2 10.2,86.2 29.32,67.08 v43.52,67.08
P0_15  (via drill 0.35)
  Top 0.254: U4.151 46.88,68.1 v44.2,68.1
  Bottom 0.254: J8.4 10.4,87.46 29.76,68.1 v44.2,68.1
P1_02
  Top 0.254: U4.130 63.5,68.79 63.5,70.28 43.99,89.78 J10.P$7
P1_03
  Top 0.254: U4.129 64,68.58 64,70.35 45.2,89.15 45.2,92.06 J10.P$8
P1_06
  Top 0.254: U4.126 65.5,67.96 65.5,70.8 49.07,87.23 J10.P$11
P1_07
  Top 0.254: U4.125 66,67.75 66,70.9 50.36,86.54 50.36,91.98 J10.P$12
P1_11
  Top 0.254: U4.92 83.02,61.44 83.02,88.5 83.42,88.9 83.42,92.09 82.24,93.27 J10.P$38
P1_12
  Top 0.254: U4.93 82.59,61.72 82.59,87.21 82.2,87.6 82.2,90.62 J10.P$37
P1_13
  Top 0.254: U4.94 82.13,61.96 82.13,86.07 80.8,87.4 80.8,92.02 J10.P$36
P1_14
  Top 0.254: U4.95 81.68,62.22 81.68,85.02 79.8,86.9 79.8,90.48 J10.P$35
P1_15
  Top 0.254: U4.96 81.2,62.45 81.2,84.2 78.2,87.2 78.2,92.08 J10.P$34
P2_00  (via drill 0.35)
  Top 0.254: v78.05,36.85 77.42,36.85 U4.69
  Bottom 0.254: R3.P$2 77.38,37.52 v78.05,36.85 78.2,36.7 78.2,31.9 74.26,27.96 J16.3
P2_01  (via drill 0.35)
  Top 0.254: 77.5,36.2 v77.5,36.1 77.46,36.1 U4.68
  Bottom 0.254: R2.P$2 76.8,36.8 v77.5,36.1 77.5,34 71.72,28.22 J16.1
P3_03  (via drill 0.35)
  Top 0.254: U4.85 77.53,48.05 81.1,48.05 84.29,51.24 84.29,61.67 87.2,64.57 87.2,72 v90.4,75.2
  Bottom 0.254: v90.4,75.2 J12.1
P3_04  (via drill 0.35)
  Top 0.254: U4.82 76.38,47.08 76.5,47.08 77.88,45.7 82.4,45.7 84.85,48.15 84.85,61.65 87.6,64.4 87.6,71 v90.5,73.9
  Bottom 0.254: v90.5,73.9 94.24,73.9 J12.2
P3_05  (via drill 0.35)
  Top 0.254: U4.81 76.08,46.67 76.31,46.67 77.18,45.8 | 77.18,45.8 77.2,45.8 | 77.18,45.8 77.88,45.1 82.56,45.1 85.25,47.8 85.25,61.48 88.01,64.23 88.01,69.91 v90.6,72.5
  Bottom 0.254: v90.6,72.5 90.76,72.66 J12.3
P3_06  (via drill 0.35)
  Top 0.254: U4.80 75.78,46.26 76.14,46.26 76.76,45.64 | 76.76,45.64 76.9,45.5 | 76.76,45.64 77.75,44.66 82.78,44.66 85.66,47.53 85.66,61.31 88.42,64.07 88.42,68.92 v90.7,71.2
  Bottom 0.254: v90.7,71.2 v90.71,71.2 90.89,71.39 94.27,71.39 J12.4
P3_07  (via drill 0.35)
  Top 0.254: U4.79 75.48,45.86 75.97,45.86 76.36,45.47 77.58,44.25 82.95,44.25 86.07,47.37 86.07,61.14 88.82,63.9 88.82,68.02 v90.8,70
  Bottom 0.254: v90.8,70 90.92,70.12 J12.5
P3_09  (via drill 0.35)
  Top 0.254: U4.77 76.12,43.8 83.08,43.8 86.47,47.2 86.47,60.97 89.23,63.73 89.23,67.13 v90.8,68.7
  Bottom 0.254: v90.8,68.7 90.94,68.85 94.27,68.85 J12.6
P3_10  (via drill 0.35)
  Top 0.254: U4.76 75.86,43.36 83.21,43.36 86.88,47.03 86.88,60.63 89.64,63.38 89.64,65.57 90.9,66.83 v90.9,67.5
  Bottom 0.254: v90.9,67.5 92.92,67.5 J12.7
P3_11  (via drill 0.35)
  Top 0.254: U4.75 75.55,42.96 83.38,42.96 87.29,46.86 87.29,60.46 90.04,63.22 90.04,65.07 90.97,66 v91,66
  Bottom 0.254: v91,66 91,66.01 91.3,66.31 94.27,66.31 J12.8
P3_12  (via drill 0.35)
  Top 0.254: U4.74 75.25,42.55 83.55,42.55 87.69,46.69 87.69,60.29 v90.7,63.3
  Bottom 0.254: v90.7,63.3 91.26,63.3 J12.9
P5_11  (via drill 0.35)
  Top 0.254: 43.9,53.4 U4.176 36.2,61.1 v10,61.1
  Bottom 0.254: v10,61.1 9.96,61.06 6.32,61.06 J7.7
P5_12  (via drill 0.35)
  Top 0.254: U4.175 35.6,62.4 v9.9,62.4
  Bottom 0.254: v9.9,62.4 7.56,62.4 J7.8
P5_13  (via drill 0.35)
  Top 0.254: U4.174 35.11,63.6 v10,63.6
  Bottom 0.254: v10,63.6 6.32,63.6 J7.5
P6_00
  Top 0.254: U4.122 69.57,69.2 69.57,71.12 51.7,89 51.7,90.64 J10.P$13
P6_01
  Top 0.254: U4.121 69.99,68.92 69.99,71.28 52.9,88.37 52.9,91.98 J10.P$14
P6_02
  Top 0.254: U4.120 70.4,68.62 70.4,71.48 54.2,87.68 54.2,90.68 J10.P$15
P6_03
  Top 0.254: U4.119 70.83,68.34 70.83,71.63 55.5,86.96 55.5,91.92 J10.P$16
P6_04
  Top 0.254: U4.118 71.32,68.13 71.32,71.82 56.9,86.24 56.9,90.52 J10.P$17
P6_05
  Top 0.254: U4.117 71.73,67.83 71.73,72.08 58,85.81 58,91.96 J10.P$18
P6_06
  Top 0.254: U4.116 72.15,67.54 72.15,72.3 59.3,85.15 59.3,90.66 J10.P$19
P6_07
  Top 0.254: U4.115 72.64,67.33 72.64,72.47 60.6,84.52 60.6,91.9 J10.P$20
P6_08
  Top 0.254: U4.99 80.6,63.97 80.6,83.6 77.2,87 77.2,90.54 J10.P$33
P6_09
  Top 0.254: U4.100 80.1,64.17 80.1,82.8 75.8,87.1 75.8,91.94 J10.P$32
P6_10
  Top 0.254: U4.101 79.6,64.38 79.6,82.1 74.7,87 74.7,90.5 J10.P$31
P6_11
  Top 0.254: U4.102 79.08,64.57 79.08,81.32 73.3,87.1 73.3,91.9 J10.P$30
P6_12
  Top 0.254: U4.103 78.5,64.7 78.5,80.31 71.8,87.02 71.8,90.6 J10.P$29
P6_13
  Top 0.254: U4.104 78,64.9 78,79.7 70.6,87.1 70.6,92.06 J10.P$28
P6_14
  Top 0.254: U4.105 77.59,65.2 77.59,79.21 69.5,87.3 69.5,90.62 J10.P$27
P6_15
  Top 0.254: U4.106 77.19,65.5 77.19,75.89 68.1,84.98 68.1,92.02 J10.P$26
P8_00
  Top 0.254: U4.133 40.2,87.5 40.2,91.48 38.91,92.77 J10.P$4
P8_01
  Top 0.254: U4.134 38.91,88.09 J10.P$3
P8_02
  Top 0.254: U4.135 37.6,88.69 37.6,92.04 J10.P$2
P8_03  (via drill 0.35)
  Top 0.254: U4.136 51.64,73.94 51.28,74.3 v50,74.3
  Bottom 0.254: J8.2 11.8,90 27.5,74.3 v50,74.3
P8_04  (via drill 0.35)
  Top 0.254: U4.137 57.68,67.19 57.68,67.2 51.48,73.4 v50.6,73.4
  Bottom 0.254: J8.1 6.32,88.68 10.9,88.68 26.18,73.4 v50.6,73.4
P8_05  (via drill 0.35)
  Top 0.254: v9.95,64.95 34.47,64.95 U4.173
  Bottom 0.254: v9.95,64.95 9.92,64.92 J7.6
P9_06  (via drill 0.35)
  Top 0.254: U4.72 77.39,39 v79.9,39
  Bottom 0.254: R10.P$2 79.22,39.68 v79.9,39 80.3,38.6 80.3,30.36 81.88,28.78 J16.9
P9_07  (via drill 0.35)
  Top 0.254: 71.19,44.48 71.05,44.62 U4.71 77.38,38.3 v79.3,38.3
  Bottom 0.254: R9.P$2 78.62,38.98 v79.3,38.3 79.34,38.26 J16.7
P9_08  (via drill 0.35)
  Top 0.254: U4.70 | U4.70 70.72,44.27 | U4.70 77.38,37.6 v78.6,37.6
  Bottom 0.254: R8.P$2 77.97,38.23 v78.6,37.6 78.81,37.39 78.81,31.41 76.8,29.4 J16.5
PA_00
  Top 0.254: U4.114 73.13,67.11 73.13,72.63 61.7,84.06 61.7,90.66 J10.P$21
PA_01
  Top 0.254: U4.113 73.55,66.82 73.55,72.88 63.1,83.33 63.1,91.94 J10.P$22
PA_08
  Top 0.254: U4.107 76.78,65.81 76.78,75.67 66.9,85.55 66.9,90.68 J10.P$25
PA_09
  Top 0.254: U4.108 76.37,66.11 76.37,75.43 65.6,86.2 65.6,91.98 J10.P$24
PA_10
  Top 0.254: U4.109 75.97,66.41 75.97,75.26 64.5,86.72 64.5,90.54 J10.P$23
R51
  Bottom 0.254: R23.P$1 31.59,6.16 J4.12
R52
  Bottom 0.254: R24.P$1 18.44,6.22 J4.9
RELAY_0  (via drill 0.35)
  Top 0.254: U4.59 73.3,33.9 85,33.9 86.67,35.57 86.67,45.09 88.1,46.52 88.1,50.5 88.34,50.74 88.34,54.31 88.84,54.82 88.84,60.14 v89.9,61.2
  Bottom 0.254: v89.9,61.2 RYS6.P$1
RELAY_1  (via drill 0.35)
  Top 0.254: U4.58 73.06,33.43 85.23,33.43 87.07,35.27 87.07,44.92 88.54,46.38 88.54,50.21 88.74,50.42 88.74,54.14 89.5,54.9 v89.5,57.3
  Bottom 0.254: v89.5,57.3 RZS3.P$1
RELAY_2  (via drill 0.35)
  Top 0.254: U4.57 72.76,33.03 85.45,33.03 87.48,35.05 87.48,44.75 88.94,46.22 88.94,50.04 89.4,50.5 v89.4,53.4
  Bottom 0.254: v89.4,53.4 RYS5.P$1
RELAY_3  (via drill 0.35)
  Top 0.254: U4.56 72.45,32.62 85.72,32.62 87.89,34.79 87.89,44.59 89.52,46.22 89.52,49.52 v89.6,49.6
  Bottom 0.254: v89.6,49.6 RXS3.P$1
RELAY_4  (via drill 0.35)
  Top 0.254: U4.55 72.15,32.21 85.91,32.21 88.29,34.59 88.29,40.42 89.3,41.43 v89.3,44.45
  Bottom 0.254: v89.3,44.45 RYS16.P$1
RELAY_5  (via drill 0.35)
  Top 0.254: U4.52 71.8,30.45 84.85,30.45 88.75,34.35 88.75,39.95 v89.35,40.55
  Bottom 0.254: v89.35,40.55 RZS8.P$1
RELAY_6  (via drill 0.35)
  Top 0.254: U4.51 | U4.51 71.54,30 85.1,30 89.5,34.4 v89.5,36.7
  Bottom 0.254: v89.5,36.7 93.5,36.7 RYS15.P$1
RELAY_7  (via drill 0.35)
  Top 0.254: v89,32.8 85.75,29.55 71.3,29.55 63.65,37.2 U4.50
  Bottom 0.254: RXS8.P$1 89.05,32.85 v89,32.8
RESET  (via drill 0.35)
  Top 0.254: 74.4,38.14 v74.41,38.15 74.71,37.85 74.71,37.37 R18.P$1 74.21,37.06 C57.P$1 73.54,39.31 U4.67
  Bottom 0.254: v74.41,38.15 88.14,51.88 88.14,75.39 92.79,80.04 J11.9
REXT
  Bottom 0.152: U3.9
  Bottom 0.254: U3.9 33.85,33.63 C47.P$1 33.83,33.67 R25.P$2
RXD0
  Bottom 0.254: U3.13 37.35,28.9 38.1,29.65 R31.P$2
RXD1
  Bottom 0.254: U3.12 35.35,30.8 35.75,31.2 36.4,31.2 R30.P$2
RXER
  Bottom 0.254: U3.17 37.75,26.9 38.85,25.8 R32.P$2
RXM
  Bottom 0.254: J4.6 25.31,21.6 23.35,21.6 22.5,22.45 22.5,26.85 23.05,27.4 U3.3
RXP
  Bottom 0.254: U3.4 22.65,27.9 21.89,27.14 21.89,22.16 22.99,21.06 J4.3
SD1_CD  (via drill 0.35)
  Top 0.254: J9.10 31.02,86.78 v32.1,85.7 | U4.146 54.46,64.05 54.46,64.07 47.91,70.61 44.09,70.61 v29.1,85.6
  Bottom 0.254: v32.1,85.7 29.2,85.7 v29.1,85.6
SD1_CLK
  Top 0.254: J9.5 26.6,95.6 28.17,94.03 31.62,94.03 32.95,92.71 32.95,89.82 56.66,66.11 U4.140
SD1_CMD
  Top 0.254: J9.3 24.37,97.95 24.37,94.58 25.43,93.53 31.05,93.53 32.54,92.04 32.54,89.5 U4.141
SD1_DAT0  (via drill 0.35)
  Top 0.254: U4.142 34.34,87 v33.5,87 | v33.6,93.5 32.6,94.5 29.9,94.5 28.8,95.6 J9.7
  Bottom 0.254: v33.5,87 33.6,87.1 v33.6,93.5
SD1_DAT1  (via drill 0.35)
  Top 0.254: U4.143 34.53,86.1 v34,86.1 | v34.7,93.9 33.6,95 30.5,95 29.9,95.6 J9.8
  Bottom 0.254: v34,86.1 34.8,86.9 34.8,93.8 v34.7,93.9
SD1_DAT2  (via drill 0.35)
  Top 0.254: U4.144 48.23,71.7 45.7,71.7 v32.7,84.7 | v26.19,85.54 25.84,85.89 22.73,85.89 21.27,87.36 21.27,93.32 22.2,94.25 J9.1
  Bottom 0.254: v32.7,84.7 27.7,84.7 26.86,85.54 v26.19,85.54
SD1_DAT3
  Top 0.254: U4.145 48.06,71.16 45.24,71.16 29.8,86.6 23.1,86.6 21.67,88.03 21.67,93.15 23.3,94.78 J9.2
SD1_WP
  Top 0.254: J9.9 21.6,85.4 24.71,85.4 40.02,70.08 47.73,70.08 54.19,63.63 U4.147
TCK  (via drill 0.35)
  Top 0.254: v82.7,52 82.7,51.7 80.44,49.44 78.26,49.44 U4.88
  Bottom 0.254: v82.7,52 82.7,52.4 87.7,57.4 87.7,77.03 93,82.33 J11.7
TDI  (via drill 0.35)
  Top 0.254: U4.91 77.94,55.65 78.42,55.65 v78.42,55.66
  Bottom 0.254: v78.42,55.66 86.34,63.58 86.34,83.53 93,90.18 J11.1
TDO  (via drill 0.35)
  Top 0.254: U4.90 77.98,54.98 v79.11,54.98
  Bottom 0.254: v79.11,54.98 84.08,54.98 86.8,57.7 86.8,81.4 93,87.6 J11.3
TMS  (via drill 0.35)
  Top 0.254: U4.89 77.86,54.16 v78.67,54.16
  Bottom 0.254: v78.67,54.16 78.72,54.21 83.91,54.21 87.25,57.55 87.25,79.37 J11.5
TXM
  Bottom 0.254: U3.5 20.75,28.4 19.4,27.05 19.4,21 20.3,20.1 J4.2
TXP
  Bottom 0.254: U3.6 20.35,28.9 18.7,27.25 18.7,19.31 J4.1
USB_N
  Top 0.254: U4.46 63.8,34.2 R5.P$1
USB_P
  Top 0.254: R6.P$1 65.1,12.95 64.25,13.8 64.25,34.46 U4.47
USB_VBUS_B
  Top 0.254: R4.P$1 62.4,12.9 63.3,13.8 63.3,29.27 58.5,34.07 58.5,34.8 U4.44
USBHS_FAULT  (via drill 0.35)
  Top 0.254: U2.3 45.4,20.89 R12.P$1 v46.32,22.3 | v61.7,22.3 v53.6,22.3 | v75.7,45.2 75.43,45.2 U4.78
  Bottom 0.254: 61.66,22.3 v61.7,22.3 61.4,22.6 61.4,29.5 66.1,34.2 66.1,35.3 75.7,44.9 v75.7,45.2 | v53.6,22.3 v46.32,22.3
USBHS_N
  Top 0.254: J3.D- 47.7,16.7 48.4,17.4 48.4,28.7 53.3,33.6 53.3,38.79 U4.31
USBHS_P
  Top 0.254: J3.D+ 49.7,16.7 48.9,17.5 48.9,28.52 53.71,33.33 53.71,38.49 U4.32
USBHS_VBUS  (via drill 0.35)
  Top 0.254: U2.5 47.35,17.86 45.2,15.71 | 45.2,15.71 45.2,16.2 C11.P$1 43.6,16.4 43.6,18.7 C15.1 | 45.2,15.71 J3.VBUS | v44.55,41.8 46.85,44.1 48.71,44.1 U4.17
  Top 0.508: U2.5 47.4,18.3 | v43.5,15 43.5,16.3 43.6,16.4
  Bottom 0.254: v43.5,15 43.5,39.37 44.55,40.66 v44.55,41.8
USBHS_VBUSEN
  Top 0.254: R1.P$1 47.4,22.8 47.4,20.89 U2.1
VBUS
  Top 0.4: J2.P$1 63.1,7.5 | 63.1,7.5 63.1,8.5 | R4.P$2 62.4,9.38 63.1,8.68 63.1,8.5 | R7.P$2 63.1,7.5 | C16.P$1 63.1,8.5
VCL_F(FLASH)  (via drill 0.35)
  Top 0.254: U4.112 71.12,63.69 71.39,63.69 v71.9,64.2
  Bottom 0.254: v71.9,64.2 71.9,64.31 C36.P$2
VDD  (via drill 0.35)  (3 unrouted)
  Top 0.254: 32.95,20.65 32.95,24.25 29.92,27.28 R26.P$2 R27.P$2 | U4.61 69.03,39.58 v69.03,39.27 v69.04,39.26 69.04,38.78 72.57,35.24 v73.08,35.24 | v75.4,57.6 75.4,57.35 U4.97 | U4.110 70.95,62.1 v70.95,62.35 | U4.123 66.3,66.64 v66.3,67.1 | U4.138 56.17,68 v55.9,68 | U4.149 52.8,63.59 v52.4,63.59 | U4.155 50.35,61.8 v50.1,61.8 | U4.171 45,55.83 v45,56.3 | U4.25 51.6,41.33 v51.6,40.9 | U4.26 51.88,40.9 v51.6,40.9 | U4.34 54.9,38.27 v54.9,37.9 | U4.48 64.94,34.48 v64.94,34.06 64.94,34.01 C61.P$2 | R18.P$2 73.5,36.26 | R20.P$1 39.85,96.95 v40.5,97.6 41.13,96.97 R21.P$1 | v76.72,47.88 76.72,48.15 U4.84 | 73.5,36.28 R18.P$2 | R18.P$2 73.51,36.21 73.08,35.78 v73.08,35.24 | v51.6,40.9 51.6,40.8 C58.P$1 | R14.P$1 R11.P$1 | v73.08,35.24 73.43,34.9 73.9,34.9 74.34,35.34 C59.P$1
  Top 0.508: v77,12.2 C34.P$1 C35.P$1 C33.P$1 77,7.44 R13.P$2 | v24,22.65 30.95,22.65 32.95,20.65 v35.03,18.57 | R11.P$1 8.7,55.6 v6.4,55.6 | J9.4 v25.5,95.7
  Bottom 0.152: U3.14 36.09,28.38
  Bottom 0.254: R23.P$2 31.59,3.49 31.6,3.65 | U3.14 37.75,28.4 39.95,30.6 C49.P$1 | 77.45,56.45 76.55,56.45 v75.4,57.6 76.74,58.94 C13.P$2 | 51.68,64.31 C56.P$2 51.57,64.42 v52.4,63.59 | 44.89,56.3 C30.P$2 | C60.P$1 54.98,37.82 v54.9,37.9 | v76.72,47.88 77.61,48.76 C32.P$1 | R10.P$1 78.36,40.5 R9.P$1 76.98,39.12 R8.P$1 R3.P$1 76.22,38.37 R2.P$1 73.09,35.24 v73.08,35.24 | v50.1,61.8 49.99,61.8 C55.P$2 | v55.9,68 55.84,68 C54.P$2 | v70.95,62.35 71.45,62.35 73.19,64.09 C10.P$2 | v66.3,67.1 67,67.8 C14.P$2
  Bottom 0.508: v35.03,18.57 35.03,3.68 33.8,2.45 31.5,2.45 | v24,22.65 23.92,22.73 FB2/2.1 | 31.5,2.45 19.02,2.45 R24.P$2 | 31.5,2.45 31.5,3.4 31.59,3.49 | v35.03,18.57 35.24,18.57 41.6,24.93 41.6,30 C48.1 41,30.6 C49.P$1 39.58,30.6 39.2,30.98 39.2,34.3 38.68,34.82 R28.P$2 R29.P$2 | v77,12.2 74.21,9.41 61.49,9.41 57.93,12.97 40.63,12.97 v35.03,18.57 | 60.5,58.9 67.5,58.9 v70.95,62.35 | 57.09,58.9 60.5,58.9 | 60.5,50.5 50.8,50.5 v45,56.3 | 60.5,46.4 57.1,46.4 v51.6,40.9 | 60.51,35.31 60.5,35.3 | 60.5,58.9 60.6,59 60.6,63.57 | 60.6,63.57 62.77,63.57 v66.3,67.1 | v69.03,39.27 67.7,40.6 60.5,40.6 57.51,40.6 54.9,37.99 v54.9,37.9 | v52.4,63.59 57.09,58.9 | v50.1,61.8 53,58.9 57.09,58.9 | v55.9,68 60.33,63.57 60.6,63.57 | v64.94,34.06 61.8,37.2 60.5,37.2 | 91.88,91.98 87.95,95.9 42.2,95.9 v40.5,97.6 25.2,97.6 | v6.4,55.6 2.5,59.5 2.5,90.3 3.9,91.7 7.8,91.7 13.7,97.6 25.2,97.6 | v25.5,95.7 25.5,97.3 25.2,97.6
  Bottom 1.016: 76.4,12.8 65,12.8 60.5,17.3 60.5,35.3 60.5,37.2 60.5,40.6 60.5,46.4 60.5,50.5 | 60.5,58.9 60.5,50.5 | 74.1,50.5 75.5,51.9 75.5,54.5 77.45,56.45 85.5,64.5 85.5,85.6 91.88,91.98 94.9,91.98 95.54,91.34 J11.2 J11.4 | 60.5,50.5 74.1,50.5 | v76.72,47.88 74.1,50.5
  Bottom 1.27: L3.2 74.9,7.6 77,9.7 v77,12.2 76.4,12.8
VDD5  (via drill 0.35)
  Top 0.254: R1.P$2 45,23.5 44.2,22.7 R12.P$2 44.15,22.25 C5.P$1 C8.P$1 v40.8,22.25
  Top 0.508: 45.41,18.4 U2.4 44.71,19.1 44.71,20.32 44.2,20.82 R12.P$2 | v73.4,11.2 75.24,13.04 v79.4,13.04
  Bottom 0.508: v40.8,22.25 42.1,20.95 42.1,14.75 43.1,13.75 58.73,13.75 60.88,11.2 v73.4,11.2 | J1.5 J1.6 85.38,10.98 85.4,11 85.4,11.7 84.06,13.04 v79.4,13.04
VDD12  (1 unrouted)
VDD_1.2
  Bottom 0.254: U3.1 30.32,26.4 C46.P$1 C45.P$1
VDD_ENET1
  Bottom 0.254: C44.P$1 27.79,26.41 | 26.36,25.81 C43.1 26.53,26.18 C44.P$1 | C44.P$1 27.79,26.59 28.09,26.9 U3.2
  Bottom 0.508: 26.22,25.95 C43.1 24.05,25.91 FB2/2.2
VDDIN
  Bottom 1.27: J1.3 J1.4 82.84,8.06 81.8,9.1 79.4,9.1 77.1,6.8 L3.1
XCIN  (1 unrouted)
  Top 0.2: 43.95,40.51 43.74,40.29
  Top 0.254: U4.20 47.55,40.82 C50.P$1 46.57,40.08 X3.P$1
XCOUT  (2 unrouted)
  Top 0.254: 46.8,39.39 47.31,39.87 U4.21 | C51.P$1 46.02,38.31 X3.P$2
XII
  Bottom 0.254: U3.8 33.35,31.4 32.94,31.81 26.12,31.81 24.92,33.01 C42.P$1 24.92,32.71 24.66,32.45 22.11,32.45 U$3.1
XOO
  Bottom 0.254: U3.7 32.85,30.82 32.38,31.29 25.27,31.29 C41.P$1 24.87,31.58 24.55,31.9 19.95,31.9 19.65,31.61 U$3.3
XTAL1  (1 unrouted)
  Top 0.152: 47.09,34.53 X4.1
  Top 0.254: U4.23 49.5,40.65 49.5,38.74 49.96,38.28 49.96,37.32 C52.P$1 50,35.9 48.63,34.53 47.09,34.53
XTAL2  (2 unrouted)
  Top 0.2: 50.06,34.25 X4.3
  Top 0.254: X4.3 51.19,35.38 C53.P$1 51.19,37.04 50.37,37.87 50.37,38.45 49.91,38.91 49.91,40.35 U4.24

## Text on the board
tNames: 2 | 40 | 1 | 2 | TDI | 1 | VDD | 39 | TDO | VDD | TMS | GND | TCK | GND | RESET | GND | 9 | 10 | 3 | Relays 2 | 2 | 1 | Step | 0 | 0 | 1 | 3 | Relays 1 | 2 | 2 | 3 | 1 | Dir | 0 | 0 | Limit Switches | 3 | 1 | 2 | 2 | 1 | 3 | 0